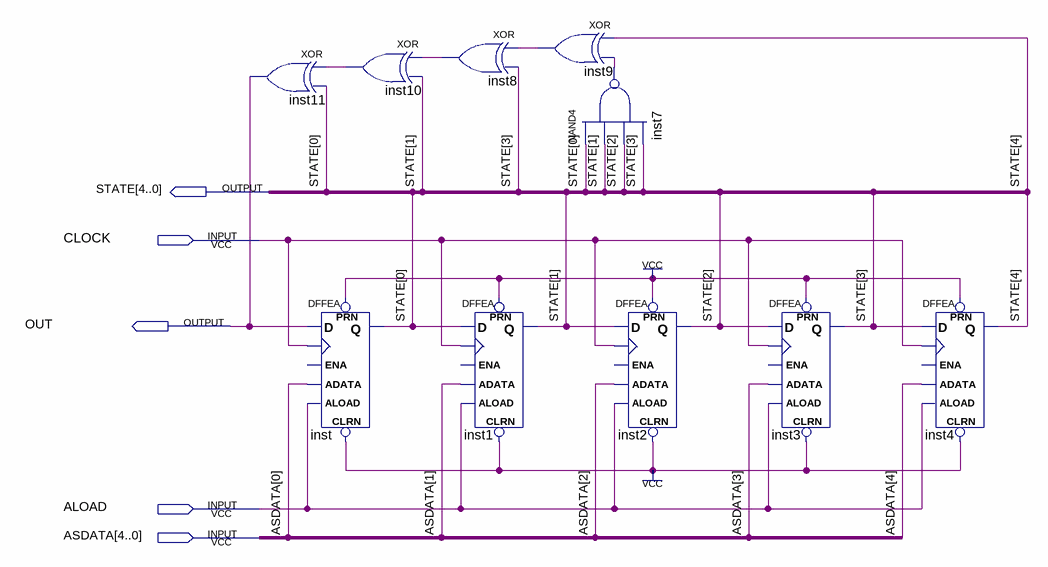
[diagram p0: schematic sheet]
// Quartus schematic DeBruijn_MGenerator.bdf as structural Verilog: 10 symbols, 5 pins
module DeBruijn_MGenerator (
  input  CLOCK,
  input  ALOAD,
  input  [4:0] ASDATA,
  output [4:0] STATE,
  output OUT
);

  wire inst7_out, inst8_out, inst9_out, inst10_out;

  xor inst11 (OUT, inst10_out, STATE[0]);
  xor inst10 (inst10_out, inst8_out, STATE[1]);
  DFFEA inst (
    .PRN(1'b1), .ALOAD(ALOAD), .ADATA(ASDATA[0]), .CLK(CLOCK), .D(OUT), .CLRN(1'b1), .Q(STATE[0]));  // open: ENA
  xor inst8 (inst8_out, inst9_out, STATE[3]);
  DFFEA inst1 (
    .PRN(1'b1), .ALOAD(ALOAD), .ADATA(ASDATA[1]), .CLK(CLOCK), .D(STATE[0]), .CLRN(1'b1), .Q(STATE[1]));  // open: ENA
  xor inst9 (inst9_out, STATE[4], inst7_out);
  nand inst7 (inst7_out, STATE[0], STATE[1], STATE[2], STATE[3]);
  DFFEA inst2 (
    .PRN(1'b1), .ALOAD(ALOAD), .ADATA(ASDATA[2]), .CLK(CLOCK), .D(STATE[1]), .CLRN(1'b1), .Q(STATE[2]));  // open: ENA
  DFFEA inst3 (
    .PRN(1'b1), .ALOAD(ALOAD), .ADATA(ASDATA[3]), .CLK(CLOCK), .D(STATE[2]), .CLRN(1'b1), .Q(STATE[3]));  // open: ENA
  DFFEA inst4 (
    .PRN(1'b1), .ALOAD(ALOAD), .ADATA(ASDATA[4]), .CLK(CLOCK), .D(STATE[3]), .CLRN(1'b1), .Q(STATE[4]));  // open: ENA
endmodule
